# Altium schematic sheet Dials.SchDoc
size A3; SheetNumber: 6; SheetTotal: 8
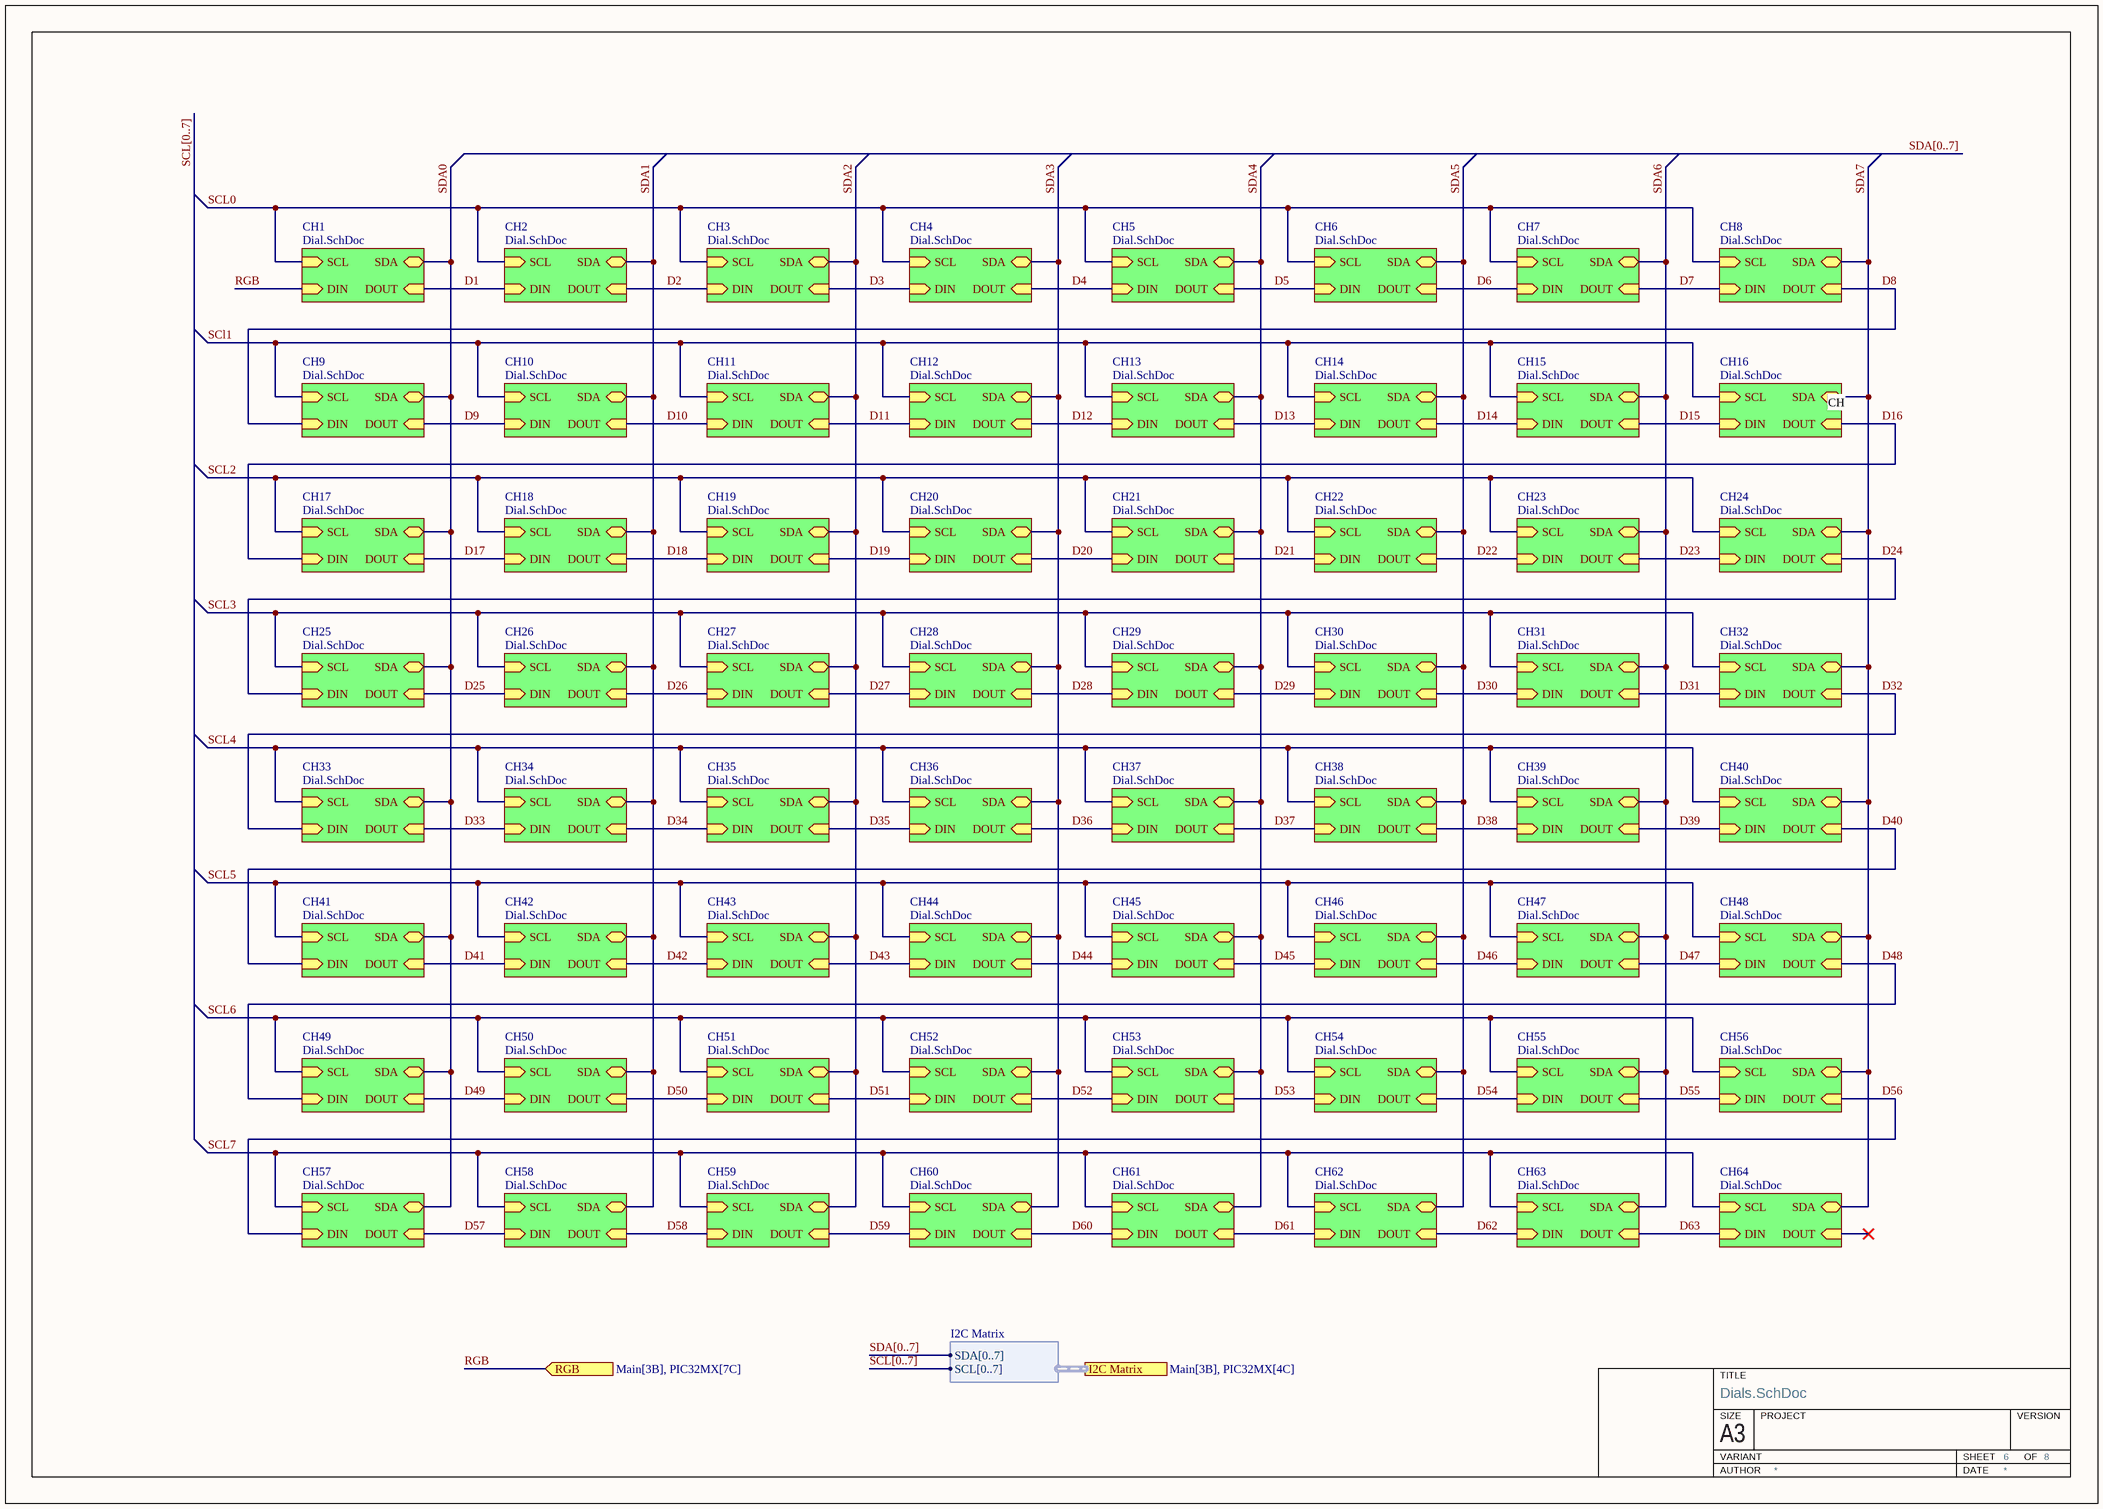
[diagram p0: Dials.SchDoc]

## Sub-sheets
CH1 = Dial.SchDoc: SCL (in), SDA (bidir), DIN (in), DOUT (in)
CH2 = Dial.SchDoc: SCL (in), SDA (bidir), DIN (in), DOUT (in)
CH3 = Dial.SchDoc: SCL (in), SDA (bidir), DIN (in), DOUT (in)
CH4 = Dial.SchDoc: SCL (in), SDA (bidir), DIN (in), DOUT (in)
CH5 = Dial.SchDoc: SCL (in), SDA (bidir), DIN (in), DOUT (in)
CH6 = Dial.SchDoc: SCL (in), SDA (bidir), DIN (in), DOUT (in)
CH7 = Dial.SchDoc: SCL (in), SDA (bidir), DIN (in), DOUT (in)
CH8 = Dial.SchDoc: SCL (in), SDA (bidir), DIN (in), DOUT (in)
CH9 = Dial.SchDoc: SCL (in), SDA (bidir), DIN (in), DOUT (in)
CH10 = Dial.SchDoc: SCL (in), SDA (bidir), DIN (in), DOUT (in)
CH11 = Dial.SchDoc: SCL (in), SDA (bidir), DIN (in), DOUT (in)
CH12 = Dial.SchDoc: SCL (in), SDA (bidir), DIN (in), DOUT (in)
CH13 = Dial.SchDoc: SCL (in), SDA (bidir), DIN (in), DOUT (in)
CH14 = Dial.SchDoc: SCL (in), SDA (bidir), DIN (in), DOUT (in)
CH15 = Dial.SchDoc: SCL (in), SDA (bidir), DIN (in), DOUT (in)
CH16 = Dial.SchDoc: SCL (in), SDA (bidir), DIN (in), DOUT (in)
CH17 = Dial.SchDoc: SCL (in), SDA (bidir), DIN (in), DOUT (in)
CH18 = Dial.SchDoc: SCL (in), SDA (bidir), DIN (in), DOUT (in)
CH19 = Dial.SchDoc: SCL (in), SDA (bidir), DIN (in), DOUT (in)
CH20 = Dial.SchDoc: SCL (in), SDA (bidir), DIN (in), DOUT (in)
CH21 = Dial.SchDoc: SCL (in), SDA (bidir), DIN (in), DOUT (in)
CH22 = Dial.SchDoc: SCL (in), SDA (bidir), DIN (in), DOUT (in)
CH23 = Dial.SchDoc: SCL (in), SDA (bidir), DIN (in), DOUT (in)
CH24 = Dial.SchDoc: SCL (in), SDA (bidir), DIN (in), DOUT (in)
CH25 = Dial.SchDoc: SCL (in), SDA (bidir), DIN (in), DOUT (in)
CH26 = Dial.SchDoc: SCL (in), SDA (bidir), DIN (in), DOUT (in)
CH27 = Dial.SchDoc: SCL (in), SDA (bidir), DIN (in), DOUT (in)
CH28 = Dial.SchDoc: SCL (in), SDA (bidir), DIN (in), DOUT (in)
CH29 = Dial.SchDoc: SCL (in), SDA (bidir), DIN (in), DOUT (in)
CH30 = Dial.SchDoc: SCL (in), SDA (bidir), DIN (in), DOUT (in)
CH31 = Dial.SchDoc: SCL (in), SDA (bidir), DIN (in), DOUT (in)
CH32 = Dial.SchDoc: SCL (in), SDA (bidir), DIN (in), DOUT (in)
CH33 = Dial.SchDoc: SCL (in), SDA (bidir), DIN (in), DOUT (in)
CH34 = Dial.SchDoc: SCL (in), SDA (bidir), DIN (in), DOUT (in)
CH35 = Dial.SchDoc: SCL (in), SDA (bidir), DIN (in), DOUT (in)
CH36 = Dial.SchDoc: SCL (in), SDA (bidir), DIN (in), DOUT (in)
CH37 = Dial.SchDoc: SCL (in), SDA (bidir), DIN (in), DOUT (in)
CH38 = Dial.SchDoc: SCL (in), SDA (bidir), DIN (in), DOUT (in)
CH39 = Dial.SchDoc: SCL (in), SDA (bidir), DIN (in), DOUT (in)
CH40 = Dial.SchDoc: SCL (in), SDA (bidir), DIN (in), DOUT (in)
CH41 = Dial.SchDoc: SCL (in), SDA (bidir), DIN (in), DOUT (in)
CH42 = Dial.SchDoc: SCL (in), SDA (bidir), DIN (in), DOUT (in)
CH43 = Dial.SchDoc: SCL (in), SDA (bidir), DIN (in), DOUT (in)
CH44 = Dial.SchDoc: SCL (in), SDA (bidir), DIN (in), DOUT (in)
CH45 = Dial.SchDoc: SCL (in), SDA (bidir), DIN (in), DOUT (in)
CH46 = Dial.SchDoc: SCL (in), SDA (bidir), DIN (in), DOUT (in)
CH47 = Dial.SchDoc: SCL (in), SDA (bidir), DIN (in), DOUT (in)
CH48 = Dial.SchDoc: SCL (in), SDA (bidir), DIN (in), DOUT (in)
CH49 = Dial.SchDoc: SCL (in), SDA (bidir), DIN (in), DOUT (in)
CH50 = Dial.SchDoc: SCL (in), SDA (bidir), DIN (in), DOUT (in)
CH51 = Dial.SchDoc: SCL (in), SDA (bidir), DIN (in), DOUT (in)
CH52 = Dial.SchDoc: SCL (in), SDA (bidir), DIN (in), DOUT (in)
CH53 = Dial.SchDoc: SCL (in), SDA (bidir), DIN (in), DOUT (in)
CH54 = Dial.SchDoc: SCL (in), SDA (bidir), DIN (in), DOUT (in)
CH55 = Dial.SchDoc: SCL (in), SDA (bidir), DIN (in), DOUT (in)
CH56 = Dial.SchDoc: SCL (in), SDA (bidir), DIN (in), DOUT (in)
CH57 = Dial.SchDoc: SCL (in), SDA (bidir), DIN (in), DOUT (in)
CH58 = Dial.SchDoc: SCL (in), SDA (bidir), DIN (in), DOUT (in)
CH59 = Dial.SchDoc: SCL (in), SDA (bidir), DIN (in), DOUT (in)
CH60 = Dial.SchDoc: SCL (in), SDA (bidir), DIN (in), DOUT (in)
CH61 = Dial.SchDoc: SCL (in), SDA (bidir), DIN (in), DOUT (in)
CH62 = Dial.SchDoc: SCL (in), SDA (bidir), DIN (in), DOUT (in)
CH63 = Dial.SchDoc: SCL (in), SDA (bidir), DIN (in), DOUT (in)
CH64 = Dial.SchDoc: SCL (in), SDA (bidir), DIN (in), DOUT (in)

## Ports
I2C Matrix (harness I2C Matrix, see Main[3B], PIC32MX[4C]), RGB (in, see Main[3B], PIC32MX[7C])

## Harnesses
I2C Matrix: SDA[0..7], SCL[0..7]

## Nets
D1: sheet CH1/DOUT, sheet CH2/DIN
D2: sheet CH2/DOUT, sheet CH3/DIN
D3: sheet CH3/DOUT, sheet CH4/DIN
D4: sheet CH4/DOUT, sheet CH5/DIN
D5: sheet CH5/DOUT, sheet CH6/DIN
D6: sheet CH6/DOUT, sheet CH7/DIN
D7: sheet CH7/DOUT, sheet CH8/DIN
D8: sheet CH8/DOUT, sheet CH9/DIN
D9: sheet CH9/DOUT, sheet CH10/DIN
D10: sheet CH10/DOUT, sheet CH11/DIN
D11: sheet CH11/DOUT, sheet CH12/DIN
D12: sheet CH12/DOUT, sheet CH13/DIN
D13: sheet CH13/DOUT, sheet CH14/DIN
D14: sheet CH14/DOUT, sheet CH15/DIN
D15: sheet CH15/DOUT, sheet CH16/DIN
D16: sheet CH16/DOUT, sheet CH17/DIN
D17: sheet CH17/DOUT, sheet CH18/DIN
D18: sheet CH18/DOUT, sheet CH19/DIN
D19: sheet CH19/DOUT, sheet CH20/DIN
D20: sheet CH20/DOUT, sheet CH21/DIN
D21: sheet CH21/DOUT, sheet CH22/DIN
D22: sheet CH22/DOUT, sheet CH23/DIN
D23: sheet CH23/DOUT, sheet CH24/DIN
D24: sheet CH24/DOUT, sheet CH25/DIN
D25: sheet CH25/DOUT, sheet CH26/DIN
D26: sheet CH26/DOUT, sheet CH27/DIN
D27: sheet CH27/DOUT, sheet CH28/DIN
D28: sheet CH28/DOUT, sheet CH29/DIN
D29: sheet CH29/DOUT, sheet CH30/DIN
D30: sheet CH30/DOUT, sheet CH31/DIN
D31: sheet CH31/DOUT, sheet CH32/DIN
D32: sheet CH32/DOUT, sheet CH33/DIN
D33: sheet CH33/DOUT, sheet CH34/DIN
D34: sheet CH34/DOUT, sheet CH35/DIN
D35: sheet CH35/DOUT, sheet CH36/DIN
D36: sheet CH36/DOUT, sheet CH37/DIN
D37: sheet CH37/DOUT, sheet CH38/DIN
D38: sheet CH38/DOUT, sheet CH39/DIN
D39: sheet CH39/DOUT, sheet CH40/DIN
D40: sheet CH40/DOUT, sheet CH41/DIN
D41: sheet CH41/DOUT, sheet CH42/DIN
D42: sheet CH42/DOUT, sheet CH43/DIN
D43: sheet CH43/DOUT, sheet CH44/DIN
D44: sheet CH44/DOUT, sheet CH45/DIN
D45: sheet CH45/DOUT, sheet CH46/DIN
D46: sheet CH46/DOUT, sheet CH47/DIN
D47: sheet CH47/DOUT, sheet CH48/DIN
D48: sheet CH48/DOUT, sheet CH49/DIN
D49: sheet CH49/DOUT, sheet CH50/DIN
D50: sheet CH50/DOUT, sheet CH51/DIN
D51: sheet CH51/DOUT, sheet CH52/DIN
D52: sheet CH52/DOUT, sheet CH53/DIN
D53: sheet CH53/DOUT, sheet CH54/DIN
D54: sheet CH54/DOUT, sheet CH55/DIN
D55: sheet CH55/DOUT, sheet CH56/DIN
D56: sheet CH56/DOUT, sheet CH57/DIN
D57: sheet CH57/DOUT, sheet CH58/DIN
D58: sheet CH58/DOUT, sheet CH59/DIN
D59: sheet CH59/DOUT, sheet CH60/DIN
D60: sheet CH60/DOUT, sheet CH61/DIN
D61: sheet CH61/DOUT, sheet CH62/DIN
D62: sheet CH62/DOUT, sheet CH63/DIN
D63: sheet CH63/DOUT, sheet CH64/DIN
RGB: port RGB, sheet CH1/DIN
SCL0: sheet CH1/SCL, sheet CH2/SCL, sheet CH3/SCL, sheet CH4/SCL, sheet CH5/SCL, sheet CH6/SCL, sheet CH7/SCL, sheet CH8/SCL
SCl1: sheet CH9/SCL, sheet CH10/SCL, sheet CH11/SCL, sheet CH12/SCL, sheet CH13/SCL, sheet CH14/SCL, sheet CH15/SCL, sheet CH16/SCL
SCL2: sheet CH17/SCL, sheet CH18/SCL, sheet CH19/SCL, sheet CH20/SCL, sheet CH21/SCL, sheet CH22/SCL, sheet CH23/SCL, sheet CH24/SCL
SCL3: sheet CH25/SCL, sheet CH26/SCL, sheet CH27/SCL, sheet CH28/SCL, sheet CH29/SCL, sheet CH30/SCL, sheet CH31/SCL, sheet CH32/SCL
SCL4: sheet CH33/SCL, sheet CH34/SCL, sheet CH35/SCL, sheet CH36/SCL, sheet CH37/SCL, sheet CH38/SCL, sheet CH39/SCL, sheet CH40/SCL
SCL5: sheet CH41/SCL, sheet CH42/SCL, sheet CH43/SCL, sheet CH44/SCL, sheet CH45/SCL, sheet CH46/SCL, sheet CH47/SCL, sheet CH48/SCL
SCL6: sheet CH49/SCL, sheet CH50/SCL, sheet CH51/SCL, sheet CH52/SCL, sheet CH53/SCL, sheet CH54/SCL, sheet CH55/SCL, sheet CH56/SCL
SCL7: sheet CH57/SCL, sheet CH58/SCL, sheet CH59/SCL, sheet CH60/SCL, sheet CH61/SCL, sheet CH62/SCL, sheet CH63/SCL, sheet CH64/SCL
SDA0: sheet CH1/SDA, sheet CH9/SDA, sheet CH17/SDA, sheet CH25/SDA, sheet CH33/SDA, sheet CH41/SDA, sheet CH49/SDA, sheet CH57/SDA
SDA1: sheet CH2/SDA, sheet CH10/SDA, sheet CH18/SDA, sheet CH26/SDA, sheet CH34/SDA, sheet CH42/SDA, sheet CH50/SDA, sheet CH58/SDA
SDA2: sheet CH3/SDA, sheet CH11/SDA, sheet CH19/SDA, sheet CH27/SDA, sheet CH35/SDA, sheet CH43/SDA, sheet CH51/SDA, sheet CH59/SDA
SDA3: sheet CH4/SDA, sheet CH12/SDA, sheet CH20/SDA, sheet CH28/SDA, sheet CH36/SDA, sheet CH44/SDA, sheet CH52/SDA, sheet CH60/SDA
SDA4: sheet CH5/SDA, sheet CH13/SDA, sheet CH21/SDA, sheet CH29/SDA, sheet CH37/SDA, sheet CH45/SDA, sheet CH53/SDA, sheet CH61/SDA
SDA5: sheet CH6/SDA, sheet CH14/SDA, sheet CH22/SDA, sheet CH30/SDA, sheet CH38/SDA, sheet CH46/SDA, sheet CH54/SDA, sheet CH62/SDA
SDA6: sheet CH7/SDA, sheet CH15/SDA, sheet CH23/SDA, sheet CH31/SDA, sheet CH39/SDA, sheet CH47/SDA, sheet CH55/SDA, sheet CH63/SDA
SDA7: sheet CH8/SDA, sheet CH16/SDA, sheet CH24/SDA, sheet CH32/SDA, sheet CH40/SDA, sheet CH48/SDA, sheet CH56/SDA, sheet CH64/SDA

## Buses and harness runs
bus SCL[0..7]
bus SDA[0..7]

## Notes on the sheet
- CH
- TITLE
- SIZE
- A3
- VARIANT
- PROJECT
- SHEET
- VERSION
- OF
- AUTHOR
- DATE